# Altium schematic sheet Power Supply.SchDoc
size A
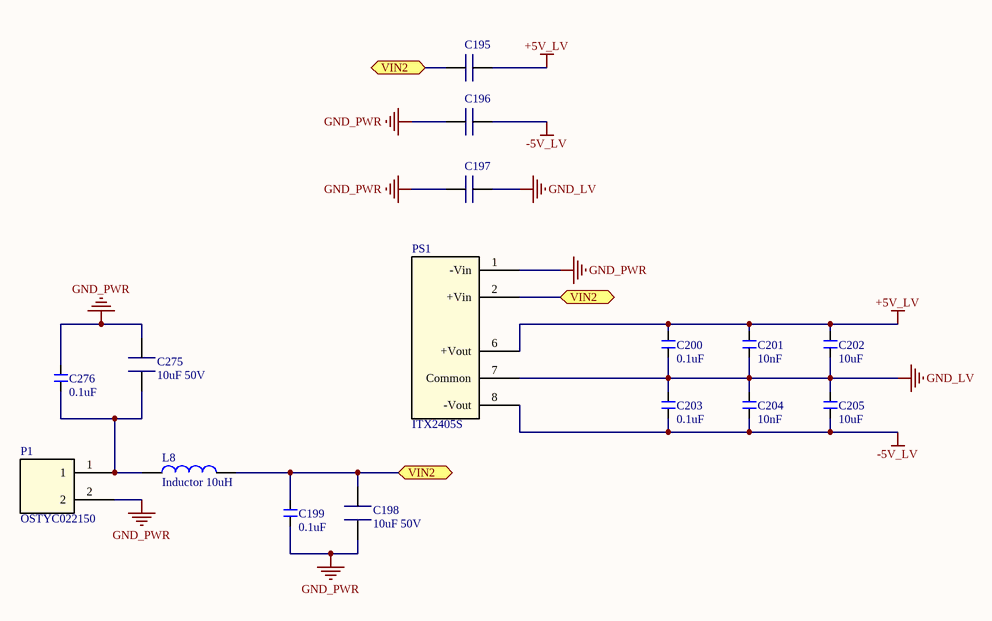
[diagram p0: Power Supply.SchDoc]

## Parts
C195  Cap 1812  [1812 (4532 Metric)]  (value not drawn)
C196  Cap 1812  [1812 (4532 Metric)]  (value not drawn)
C197  Cap 1812  [1812 (4532 Metric)]  (value not drawn)
C198  value 10uF 50V  [1206]  (hidden comment: Cap 1206)
C199  value 0.1uF  [0603 (1608 Metric)]  (hidden comment: Cap 0603_new)
C200  value 0.1uF  [0603 (1608 Metric)]  (hidden comment: Cap 0603_new)
C201  value 10nF  [0603 (1608 Metric)]  (hidden comment: Cap 0603_new)
C202  value 10uF  [0603 (1608 Metric)]  (hidden comment: Cap 0603_new)
C203  value 0.1uF  [0603 (1608 Metric)]  (hidden comment: Cap 0603_new)
C204  value 10nF  [0603 (1608 Metric)]  (hidden comment: Cap 0603_new)
C205  value 10uF  [0603 (1608 Metric)]  (hidden comment: Cap 0603_new)
C275  value 10uF 50V  [1206]  (hidden comment: Cap 1206)
C276  value 0.1uF  [0603 (1608 Metric)]  (hidden comment: Cap 0603_new)
L8  Inductor 10uH  [Inductor Surface Mount]
P1  OSTYC022150  [2 pin Terminal]
PS1  ITX2405S  [8 SIP]

## Ports
VIN2

## Nets
+5V_LV: C195.2(OUT) C200.2(OUT) C201.2(OUT) C202.2(OUT) PS1.6(+Vout)
-5V_LV: C196.2(OUT) C203.1(OUT) C204.1(OUT) C205.1(OUT) PS1.8(-Vout)
GND_LV: C197.2(OUT) C200.1(OUT) C201.1(OUT) C202.1(OUT) C203.2(OUT) C204.2(OUT) C205.2(OUT) PS1.7(Common)
GND_PWR: C196.1(OUT) C197.1(OUT) C198.1(OUT) C199.1(OUT) C275.2(OUT) C276.2(OUT) P1.2 PS1.1(-Vin)
VIN2: C195.1(OUT) C198.2(OUT) C199.2(OUT) L8.2(OUT) PS1.2(+Vin) ; port VIN2
NetC275_1: C275.1(OUT) C276.1(OUT) L8.1(OUT) P1.1

## Library data of the parts
C195-C197 = Cap 3kV 220pF: CAP CER 220PF 3KV C0G 1812; Part: 445-2380-1-ND
C198 C275 = Cap 1206: CAP CER 10UF 50V X5R 1206; Part: 587-3248-1-ND
C199 C200 C203 C276 = Cap 0603_new: CAP CER 0.1UF 50V Y5V 0603; part: 311-1343-6-ND
C201 C204 = Cap 0603_new: CAP CER 0603 10NF 50V U2J 5%; part: 399-13384-1-ND
C202 C205 = Cap 0603_new: CAP CER 10UF 35V X5R 0805; part: 490-10515-1-ND
L8 = Inductor 10uH: FIXED IND 10UH 1.19A 110 MOHM; Part: 732-1103-1-ND
P1 = 2 pin Terminal
PS1 = ITX2405S: DC/DC CONVERTER +/-5V 6W; Part: 1470-2542-5-ND